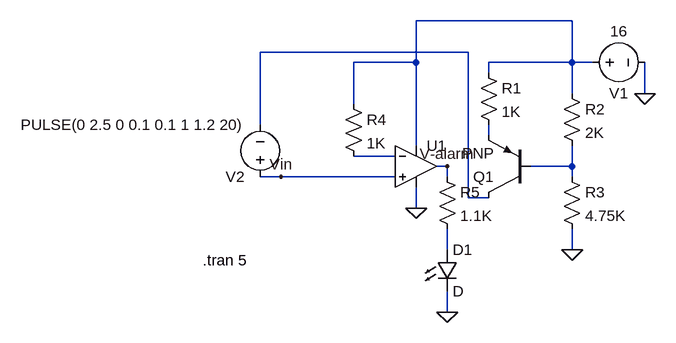
[diagram p0: schematic Alarm-System.asc]
Alarm-System.asc, the LTspice schematic file:
Version 4.1
SHEET 1 880 680
WIRE 432 -48 192 -48
WIRE 272 0 -48 0
WIRE 192 16 192 -48
WIRE 192 16 96 16
WIRE 432 16 432 -48
WIRE 432 16 304 16
WIRE 464 16 432 16
WIRE 304 32 304 16
WIRE 432 64 432 16
WIRE 544 64 544 16
WIRE 96 80 96 16
WIRE -48 112 -48 0
WIRE 304 128 304 112
WIRE 192 144 192 16
WIRE 160 160 96 160
WIRE 240 176 224 176
WIRE 432 176 432 144
WIRE 432 176 368 176
WIRE -16 192 -48 192
WIRE 160 192 -16 192
WIRE 240 192 240 176
WIRE 432 192 432 176
WIRE 272 224 272 0
WIRE 304 224 272 224
WIRE 192 240 192 208
WIRE 240 304 240 272
WIRE 432 304 432 272
WIRE 240 400 240 368
FLAG 432 304 0
FLAG 544 64 0
FLAG 192 240 0
FLAG -16 192 Vin
FLAG 240 176 V-alarm
FLAG 240 400 0
SYMBOL OpAmps\\UniversalOpAmp2 192 176 R0
SYMATTR InstName U1
SYMBOL pnp 368 224 R180
SYMATTR InstName Q1
SYMBOL res 288 16 R0
SYMATTR InstName R1
SYMATTR Value 1K
SYMATTR SpiceLine tol=1 pwr=0.1
SYMBOL res 416 48 R0
SYMATTR InstName R2
SYMATTR Value 2K
SYMATTR SpiceLine tol=1 pwr=0.1
SYMBOL res 416 176 R0
SYMATTR InstName R3
SYMATTR Value 4.75K
SYMATTR SpiceLine tol=1 pwr=0.1
SYMBOL voltage 448 16 R270
WINDOW 0 -32 56 VBottom 2
WINDOW 3 32 56 VTop 2
WINDOW 123 0 0 Left 0
WINDOW 39 0 0 Left 0
SYMATTR InstName V1
SYMATTR Value 16
SYMBOL res 80 64 R0
SYMATTR InstName R4
SYMATTR Value 1K
SYMATTR SpiceLine tol=1 pwr=0.1
SYMBOL voltage -48 208 R180
WINDOW 123 0 0 Left 0
WINDOW 39 0 0 Left 0
SYMATTR InstName V2
SYMATTR Value PULSE(0 2.5 0 0.1 0.1 1 1.2 20)
SYMBOL res 224 176 R0
SYMATTR InstName R5
SYMATTR Value 1.1K
SYMATTR SpiceLine tol=1 pwr=0.1
SYMBOL LED 224 304 R0
SYMATTR InstName D1
TEXT -136 320 Left 2 !.tran 5

The netlist it stands for:
* Alarm-System.asc
X§U1 Vin N004 N001 0 V-alarm level2 Avol=1Meg GBW=10Meg Slew=10Meg Ilimit=25m Rail=0 Vos=0 En=0 Enk=0 In=0 Ink=0 Rin=500Meg  ; pins In+ In- V+ V- OUT
Q1 N002 N005 N003 0 PNP
R1 N001 N003 1K tol=1 pwr=0.1
R2 N001 N005 2K tol=1 pwr=0.1
R3 N005 0 4.75K tol=1 pwr=0.1
V1 N001 0 16
R4 N001 N004 1K tol=1 pwr=0.1
V2 Vin N002 PULSE(0 2.5 0 0.1 0.1 1 1.2 20)
R5 V-alarm N006 1.1K tol=1 pwr=0.1
D1 N006 0 D
.model D D
.lib standard.dio
.model NPN NPN
.model PNP PNP
.lib standard.bjt
.tran 5
.lib UniversalOpAmp2.lib
.backanno
.end